# EAGLE design hss-mag-enc-v2 (EAGLE 7.6.0)
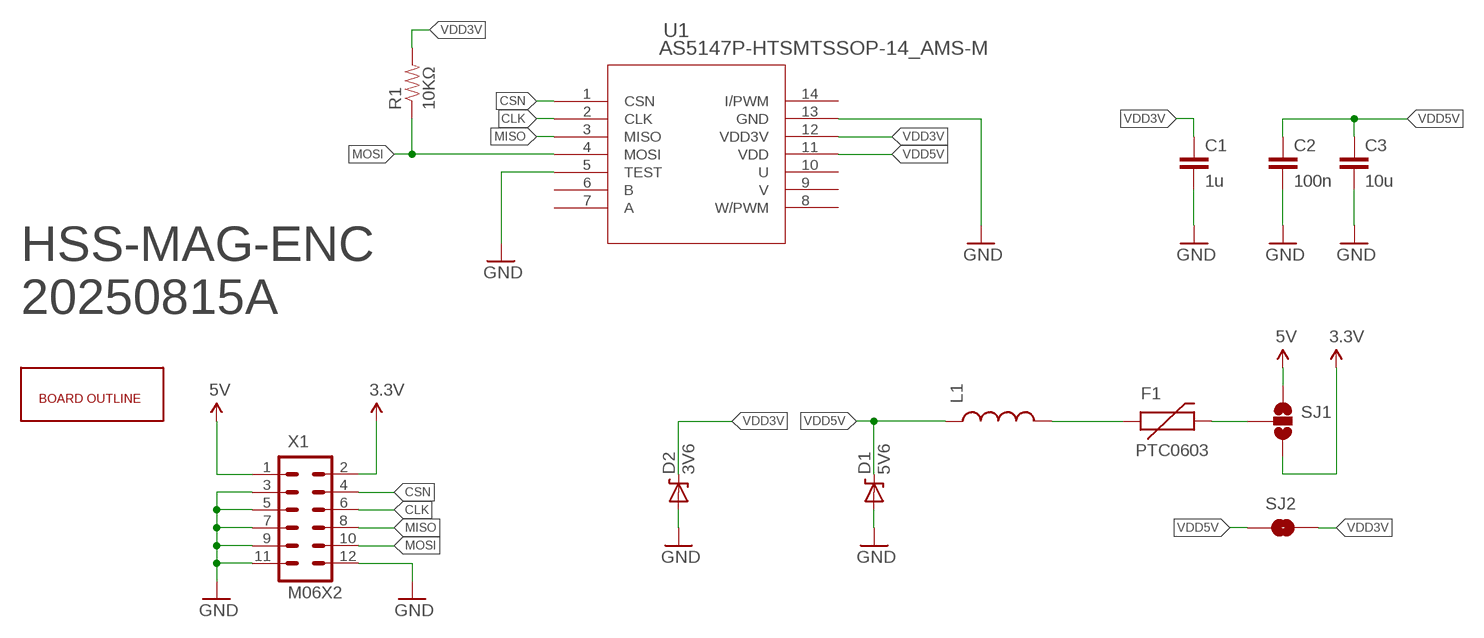
[diagram p0: schematic, sheet 1]

## Parts
C1  1u  CAP0805  [0805]
C2  100n  CAP0805  [0805]
C3  10u  CAP0805  [0805]
D1  5V6  DIODE-ZENER-BZT52  [SOD-323]
D2  3V6  DIODE-ZENER-BZT52  [SOD-323]
F1  PTC0603  [0603]
L1  INDUCTOR0805  [0805]
R1  10KΩ  RESISTOR0603-RES  [0603-RES]
SJ1  SOLDERJUMPER_2WAYS  [SJ_3]
SJ2  SOLDERJUMPERNO  [SJ_2S-NO]
U1  AS5147P-HTSMTSSOP-14_AMS-M  [TSSOP-14_AMS-M]
U$1  BOARD-OUTLINE-V2  [BOARD-OUTLINE-2]
X1  M06X2  [2X6]

## Nets
3.3V: SJ1.3 X1.2
5V: SJ1.1 X1.1
CLK: U1.2(CLK) X1.6
CSN: U1.1(CSN) X1.4
GND: C1.2 C2.2 C3.2 D1.2(A) D2.2(A) U1.5(TEST) U1.13(GND) X1.3 X1.5 X1.7 X1.9 X1.11 X1.12
MISO: U1.3(MISO) X1.8
MOSI: R1.1 U1.4(MOSI) X1.10
N$1: F1.1 L1.2
N$2: F1.2 SJ1.2
VDD3V: C1.1 D2.1(C) R1.2 SJ2.2 U1.12(VDD3V)
VDD5V: C2.1 C3.1 D1.1(C) L1.1 SJ2.1 U1.11(VDD)
Unconnected: U1.6(B) U1.7(A) U1.8(W/PWM) U1.9(V) U1.10(U) U1.14(I/PWM)

## Notes on the sheet
- HSS-MAG-ENC
  20250815A

## Library data of the parts
C1-C3 = hss-mag-enc:CAP: Capacitor Standard 0603 ceramic capacitor, and 0.1" leaded capacitor.
D1 D2 = hss-mag-enc:DIODE-ZENER: Zener Diode Production Part - 8199 3.4V Zener Voltage
F1 = hss-mag-enc:PTC: Resettable Fuse PTC Resettable Fuse. Spark Fun Electronics SKU : COM-08357
L1 = hss-mag-enc:INDUCTOR: Inductors Basic Inductor/Choke - 0603 and 1206. Footprints are not proven and vary greatly between part numbers.
R1 = hss-mag-enc:RESISTOR: Resistor Basic schematic elements and footprints for 0603, 1206, and PTH resistors.
SJ1 = hss-mag-enc:SOLDERJUMPER_2WAY: Solder Jumper 2 way solder jumper
SJ2 = hss-mag-enc:SOLDERJUMPER: Solder Jumper Standard SMD solder jumper. Used to automate production. Two varients : Normally Open and Normally Closed are the same, but have different paste layers. NC will have a large amount of paste and should jumper during reflow.
U1 = hss-mag-enc:AS5147P-HTSM; COPYRIGHT: Copyright (C) 2025 Ultra Librarian. All rights reserved.; MANUFACTURER_NAME: AMS; MANUFACTURER_PART_NUMBER: AS5147P-HTSM
U$1 = hss-mag-enc:BOARD-OUTLINE
X1 = hss-mag-enc:M06X2

## Board
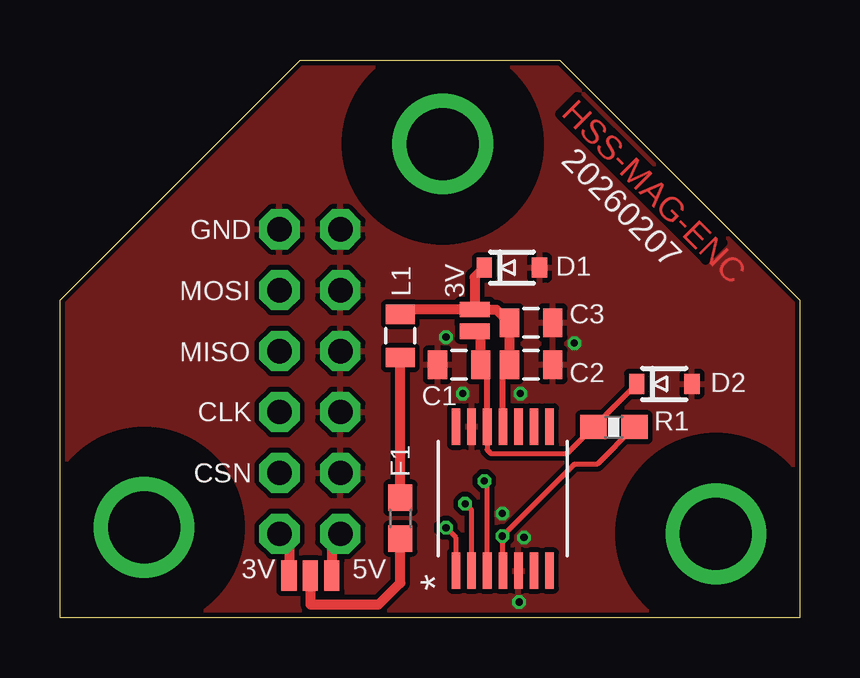
[diagram p1: board, top side]
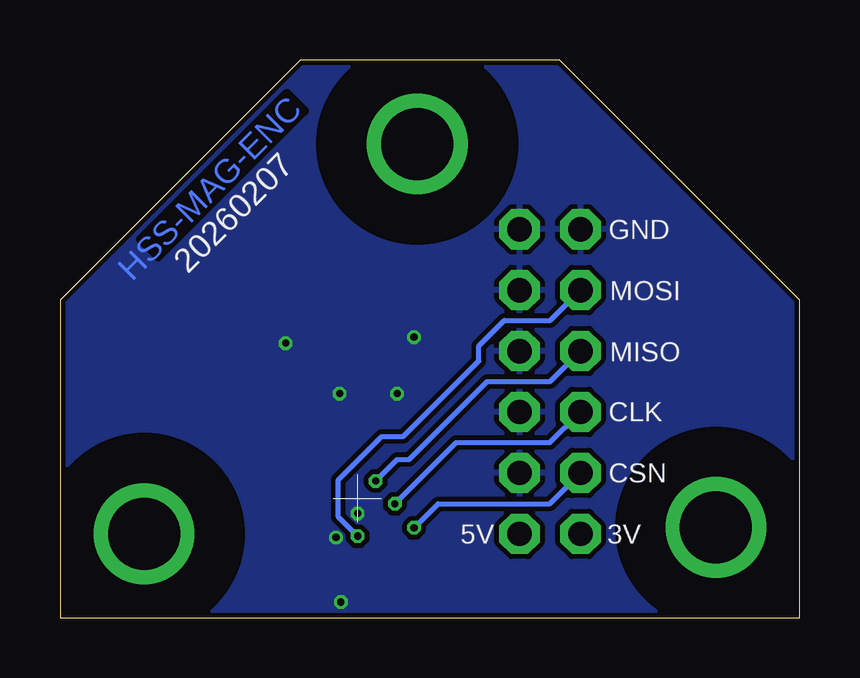
[diagram p2: board, bottom side, seen from below]

Size 30.83 x 23.26 mm. Coordinates in mm from the lower left corner, seen from the top.
Copper layers (1*16): Top 0.035mm / dielectric 0.2mm / Bottom 0.035mm
Design rules "jlcpcb-4layers *": minimum track width 3.5mil, minimum drill 0.2mm, track to track 6mil, track to pad 6mil, pad to pad 6mil, via to via 6mil, smd to smd 5mil, copper to edge 0.2mm, drill to drill 6mil, minimum pad ring 10mil, minimum via ring 0.13mm, stop-mask expansion 0.05mm, vias tented up to drill 16mil, thermal gap 8mil

### Footprints (pad centres in the part's own frame; a part is rotated, then mirrored left to right if it is on the bottom)
0805 = smd 0.8 x 1.2: 1 -0.9,0; 2 0.9,0
SOD-323 = smd 0.63 x 0.83: 1 -1.15,0; 2 1.15,0
0603 = smd 1.1 x 1: 1 -0.85,0; 2 0.85,0
0603-RES = smd 1.1 x 1: 1 -0.85,0; 2 0.85,0
SJ_3 = smd 0.635 x 1.27: 1 -0.889,0; 2 0,0; 3 0.889,0
SJ_2S-NO = smd 0.635 x 1.27: 1 -0.45,0; 2 0.45,0
TSSOP-14_AMS-M = smd 1.511 x 0.356: 1 -3.004,1.95; 2 -3.004,1.3; 3 -3.004,0.65; 4 -3.004,0; 5 -3.004,-0.65; 6 -3.004,-1.3; 7 -3.004,-1.95; 8 3.004,-1.95; 9 3.004,-1.3; 10 3.004,-0.65; 11 3.004,0; 12 3.004,0.65; 13 3.004,1.3; 14 3.004,1.95
BOARD-OUTLINE-2 = drill 3: M1 3.5,3.5; M2 27.331,3.763; M3 14.884,19.758
2X6 = drill 1.016 pad 1.676 octagon: 1 0,0; 2 0,2.54; 3 2.54,0; 4 2.54,2.54; 5 5.08,0; 6 5.08,2.54; 7 7.62,0; 8 7.62,2.54; 9 10.16,0; 10 10.16,2.54; 11 12.7,0; 12 12.7,2.54

### Placement (x,y rotation side)
C1  16.63,10.55 180 top
C2  19.63,10.55 0 top
C3  19.63,12.3 0 top
D1  18.83,14.6 0 top
D2  25.18,9.75 0 top
F1  14.18,4.15 270 top
L1  14.18,11.75 270 top
R1  23.08,7.95 180 top
SJ1  10.43,1.75 180 top
SJ2  17.28,12.4 270 top
U1  18.45,4.97 90 top
U$1  30.83,0 0 bottom
X1  11.68,3.5 90 top

### Tracks (layer width: path | path; a pad name or v marks a point on that pad's centre or on a via)
3.3V
  Top 0.406: X1.2 9.54,3.1 SJ1.3
5V
  Top 0.406: X1.1 11.32,3.14 SJ1.1
CLK  (via drill 0.3)
  Top 0.203: U1.2 17.15,4.48 v16.88,4.75
  Bottom 0.203: v16.88,4.75 14.33,7.3 10.42,7.3 X1.6
CSN  (via drill 0.3)
  Top 0.203: U1.1 16.5,3.33 v16.08,3.75
  Bottom 0.203: v16.08,3.75 15.08,4.75 10.43,4.75 X1.4
GND  (via drill 0.3)
  other vias: 16.78,9.35 18.43,4.35 19.33,3.35 16.08,11.7 21.43,11.45 19.18,9.35 19.13,0.65
  pour Top (isolate 0.203): 30.83,0 -0.17,0 -0.17,24 30.83,24
  pour Bottom (isolate 0.203): 30.83,0 -0.17,0 -0.17,24 30.83,24
MISO  (via drill 0.3)
  Top 0.203: U1.3 17.8,5.58 v17.68,5.7
  Bottom 0.203: X1.8 10.41,9.85 13.03,9.85 16.28,6.6 16.78,6.6 v17.68,5.7
MOSI  (via drill 0.3)
  Top 0.203: U1.4 18.45,3.38 v18.43,3.4 21.43,6.4 22.38,6.4 R1.1
  Bottom 0.203: v18.43,3.4 19.23,4.2 19.23,5.75 17.43,7.55 16.53,7.55 13.38,10.7 13.38,11.34 12.32,12.4 10.4,12.4 X1.10
N$1
  Top 0.406: F1.1 L1.2
N$2
  Top 0.406: SJ1.2 10.43,0.55 13.28,0.55 14.18,1.45 F1.2
VDD3V
  Top 0.203: U1.12 17.8,7 17.95,6.85 21.13,6.85 R1.2 D2.1
  Top 0.254: U1.12 17.8,10.28 C1.1
  Top 0.406: C1.1 17.53,11.7 SJ2.2
VDD5V
  Top 0.254: U1.11 18.45,10.32 C2.1
  Top 0.406: C2.1 C3.1 18.18,12.85 SJ2.1 | D1.1 17.28,14.2 SJ2.1 | SJ2.1 14.18,12.85 L1.1

### Text on the board
Top: HSS-MAG-ENC
Bottom: HSS-MAG-ENC
tPlace: 20260207
bPlace: 20260207
tNames: GND | MOSI | 3V | MISO | CLK | CSN | 3V | 5V
bNames: GND | MOSI | MISO | CLK | CSN | 3V | 5V
tStop: HSS-MAG-ENC
bStop: HSS-MAG-ENC
tDocu: 5V | 3V